# Altium schematic sheet Decap.SchDoc
size A3
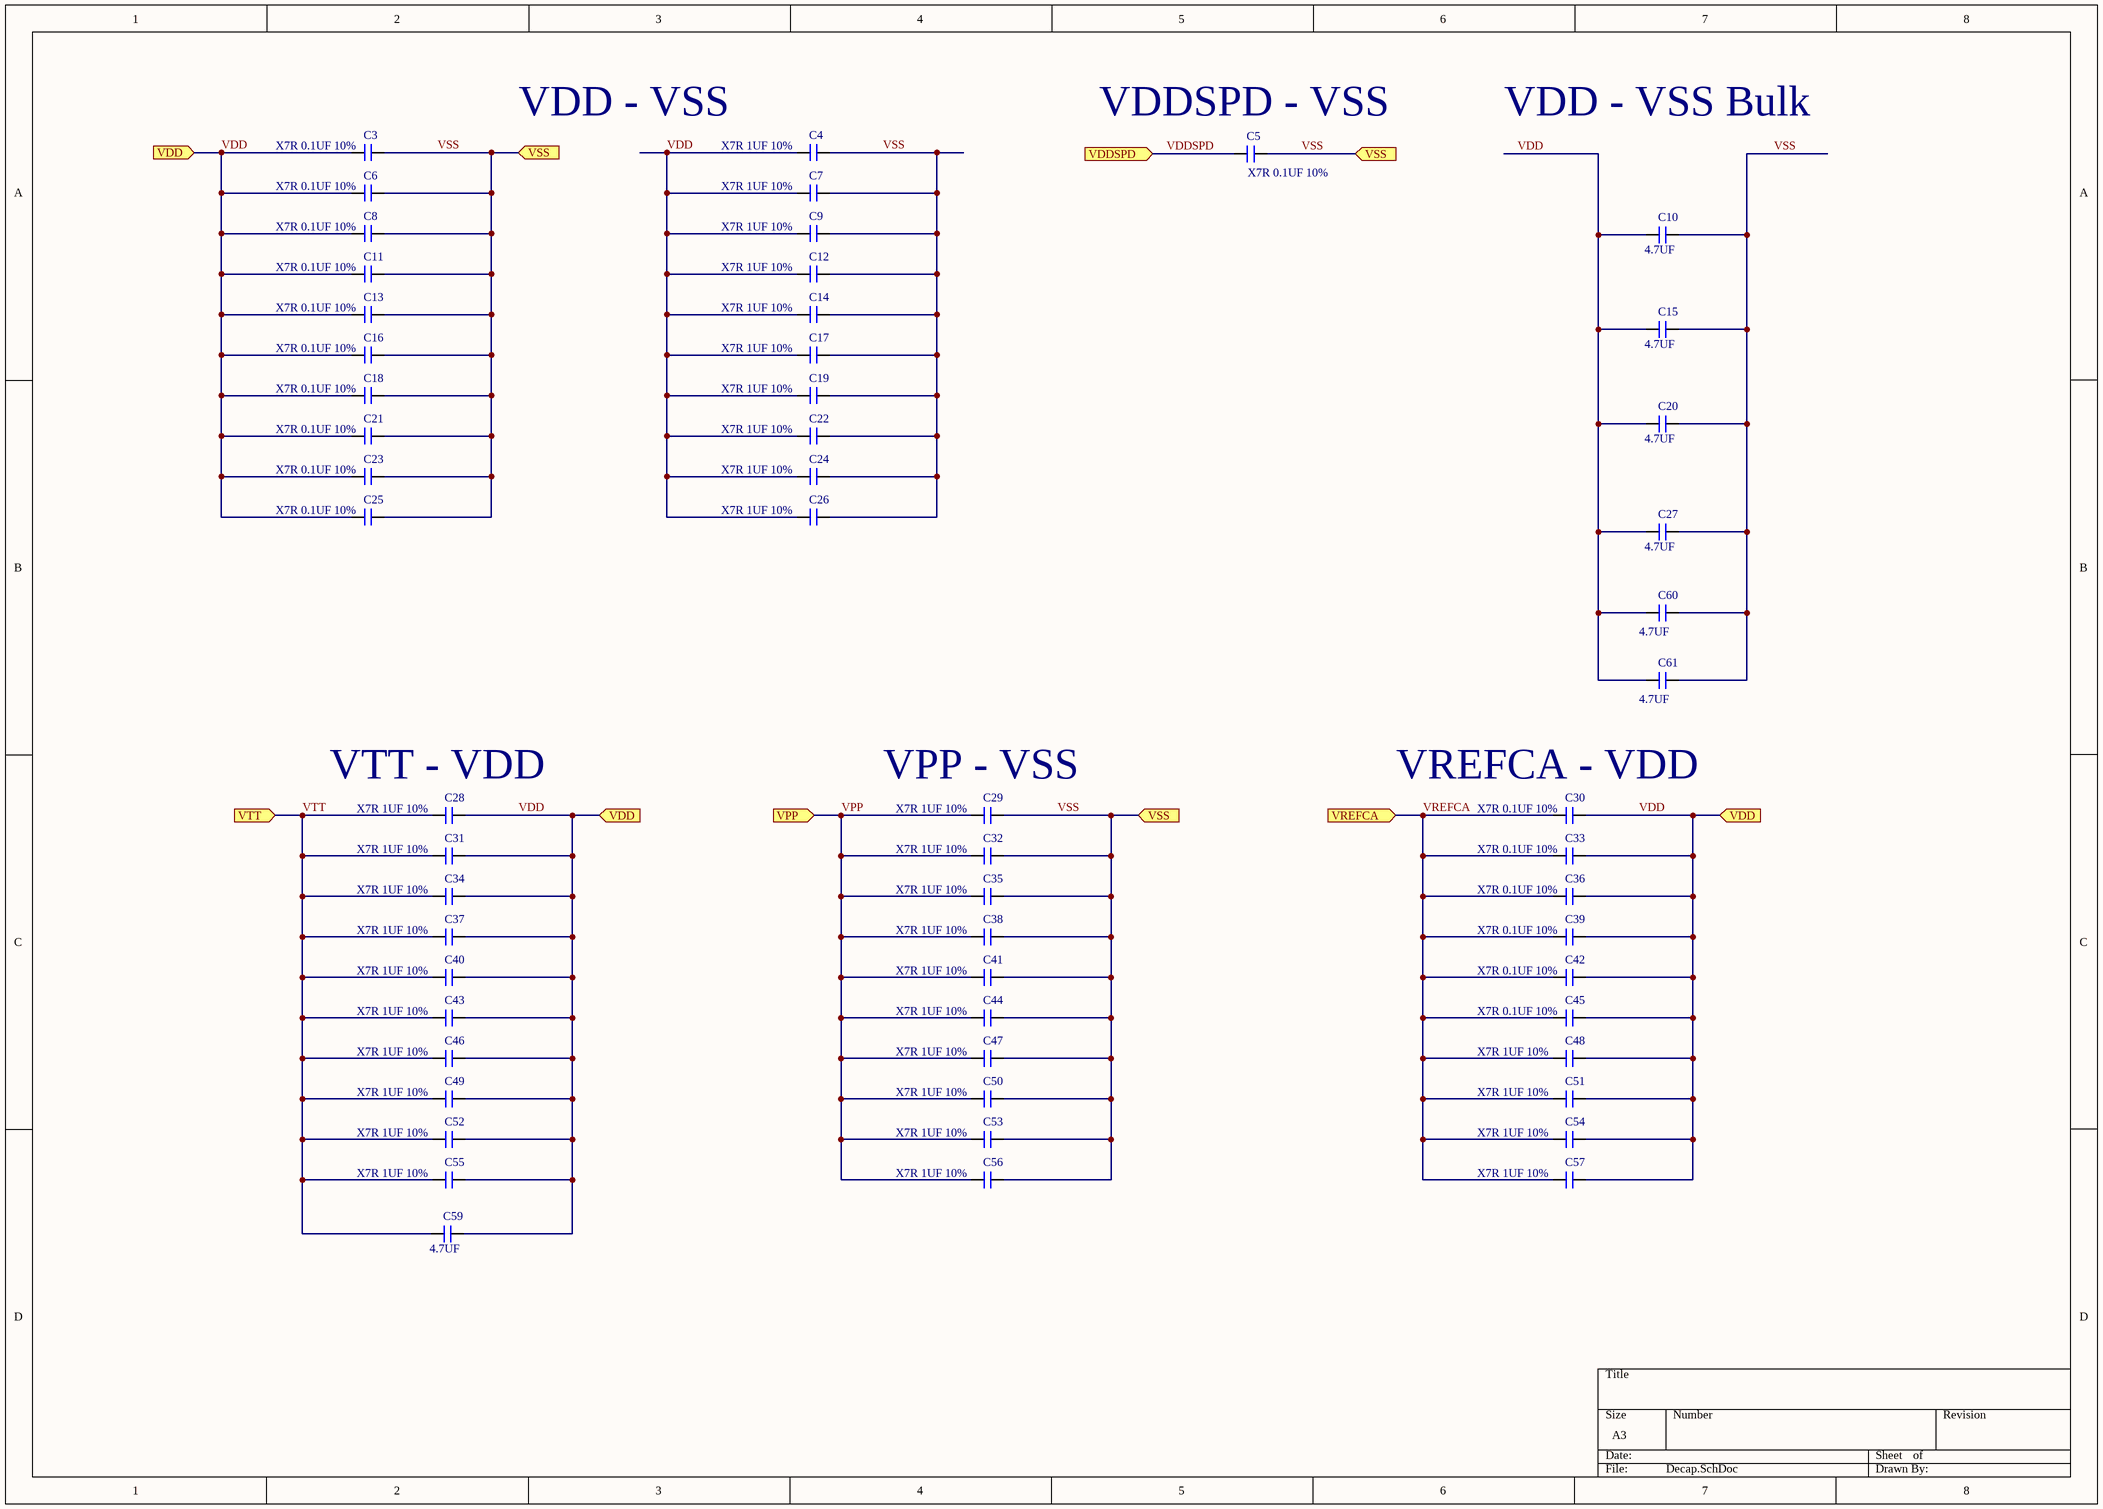
[diagram p0: Decap.SchDoc]

## Parts
C3  Capacitance: X7R 0.1UF 10%  [Capacitor 0402]  (hidden comment: Capacitor 0402)
C4  Capacitance: X7R 1UF 10%  [Capacitor 0402]  (hidden comment: Capacitor 0402)
C5  Capacitance: X7R 0.1UF 10%  [Capacitor 0402]  (hidden comment: Capacitor 0402)
C6  Capacitance: X7R 0.1UF 10%  [Capacitor 0402]  (hidden comment: Capacitor 0402)
C7  Capacitance: X7R 1UF 10%  [Capacitor 0402]  (hidden comment: Capacitor 0402)
C8  Capacitance: X7R 0.1UF 10%  [Capacitor 0402]  (hidden comment: Capacitor 0402)
C9  Capacitance: X7R 1UF 10%  [Capacitor 0402]  (hidden comment: Capacitor 0402)
C10  Capacitance: 4.7UF  [Capacitor 0603]  (hidden comment: Capacitor 0603)
C11  Capacitance: X7R 0.1UF 10%  [Capacitor 0402]  (hidden comment: Capacitor 0402)
C12  Capacitance: X7R 1UF 10%  [Capacitor 0402]  (hidden comment: Capacitor 0402)
C13  Capacitance: X7R 0.1UF 10%  [Capacitor 0402]  (hidden comment: Capacitor 0402)
C14  Capacitance: X7R 1UF 10%  [Capacitor 0402]  (hidden comment: Capacitor 0402)
C15  Capacitance: 4.7UF  [Capacitor 0603]  (hidden comment: Capacitor 0603)
C16  Capacitance: X7R 0.1UF 10%  [Capacitor 0402]  (hidden comment: Capacitor 0402)
C17  Capacitance: X7R 1UF 10%  [Capacitor 0402]  (hidden comment: Capacitor 0402)
C18  Capacitance: X7R 0.1UF 10%  [Capacitor 0402]  (hidden comment: Capacitor 0402)
C19  Capacitance: X7R 1UF 10%  [Capacitor 0402]  (hidden comment: Capacitor 0402)
C20  Capacitance: 4.7UF  [Capacitor 0603]  (hidden comment: Capacitor 0603)
C21  Capacitance: X7R 0.1UF 10%  [Capacitor 0402]  (hidden comment: Capacitor 0402)
C22  Capacitance: X7R 1UF 10%  [Capacitor 0402]  (hidden comment: Capacitor 0402)
C23  Capacitance: X7R 0.1UF 10%  [Capacitor 0402]  (hidden comment: Capacitor 0402)
C24  Capacitance: X7R 1UF 10%  [Capacitor 0402]  (hidden comment: Capacitor 0402)
C25  Capacitance: X7R 0.1UF 10%  [Capacitor 0402]  (hidden comment: Capacitor 0402)
C26  Capacitance: X7R 1UF 10%  [Capacitor 0402]  (hidden comment: Capacitor 0402)
C27  Capacitance: 4.7UF  [Capacitor 0603]  (hidden comment: Capacitor 0603)
C28  Capacitance: X7R 1UF 10%  [Capacitor 0402]  (hidden comment: Capacitor 0402)
C29  Capacitance: X7R 1UF 10%  [Capacitor 0402]  (hidden comment: Capacitor 0402)
C30  Capacitance: X7R 0.1UF 10%  [Capacitor 0402]  (hidden comment: Capacitor 0402)
C31  Capacitance: X7R 1UF 10%  [Capacitor 0402]  (hidden comment: Capacitor 0402)
C32  Capacitance: X7R 1UF 10%  [Capacitor 0402]  (hidden comment: Capacitor 0402)
C33  Capacitance: X7R 0.1UF 10%  [Capacitor 0402]  (hidden comment: Capacitor 0402)
C34  Capacitance: X7R 1UF 10%  [Capacitor 0402]  (hidden comment: Capacitor 0402)
C35  Capacitance: X7R 1UF 10%  [Capacitor 0402]  (hidden comment: Capacitor 0402)
C36  Capacitance: X7R 0.1UF 10%  [Capacitor 0402]  (hidden comment: Capacitor 0402)
C37  Capacitance: X7R 1UF 10%  [Capacitor 0402]  (hidden comment: Capacitor 0402)
C38  Capacitance: X7R 1UF 10%  [Capacitor 0402]  (hidden comment: Capacitor 0402)
C39  Capacitance: X7R 0.1UF 10%  [Capacitor 0402]  (hidden comment: Capacitor 0402)
C40  Capacitance: X7R 1UF 10%  [Capacitor 0402]  (hidden comment: Capacitor 0402)
C41  Capacitance: X7R 1UF 10%  [Capacitor 0402]  (hidden comment: Capacitor 0402)
C42  Capacitance: X7R 0.1UF 10%  [Capacitor 0402]  (hidden comment: Capacitor 0402)
C43  Capacitance: X7R 1UF 10%  [Capacitor 0402]  (hidden comment: Capacitor 0402)
C44  Capacitance: X7R 1UF 10%  [Capacitor 0402]  (hidden comment: Capacitor 0402)
C45  Capacitance: X7R 0.1UF 10%  [Capacitor 0402]  (hidden comment: Capacitor 0402)
C46  Capacitance: X7R 1UF 10%  [Capacitor 0402]  (hidden comment: Capacitor 0402)
C47  Capacitance: X7R 1UF 10%  [Capacitor 0402]  (hidden comment: Capacitor 0402)
C48  Capacitance: X7R 1UF 10%  [Capacitor 0402]  (hidden comment: Capacitor 0402)
C49  Capacitance: X7R 1UF 10%  [Capacitor 0402]  (hidden comment: Capacitor 0402)
C50  Capacitance: X7R 1UF 10%  [Capacitor 0402]  (hidden comment: Capacitor 0402)
C51  Capacitance: X7R 1UF 10%  [Capacitor 0402]  (hidden comment: Capacitor 0402)
C52  Capacitance: X7R 1UF 10%  [Capacitor 0402]  (hidden comment: Capacitor 0402)
C53  Capacitance: X7R 1UF 10%  [Capacitor 0402]  (hidden comment: Capacitor 0402)
C54  Capacitance: X7R 1UF 10%  [Capacitor 0402]  (hidden comment: Capacitor 0402)
C55  Capacitance: X7R 1UF 10%  [Capacitor 0402]  (hidden comment: Capacitor 0402)
C56  Capacitance: X7R 1UF 10%  [Capacitor 0402]  (hidden comment: Capacitor 0402)
C57  Capacitance: X7R 1UF 10%  [Capacitor 0402]  (hidden comment: Capacitor 0402)
C59  Capacitance: 4.7UF  [Capacitor 0603]  (hidden comment: Capacitor 0603)
C60  Capacitance: 4.7UF  [Capacitor 0603]  (hidden comment: Capacitor 0603)
C61  Capacitance: 4.7UF  [Capacitor 0603]  (hidden comment: Capacitor 0603)

## Ports
VDD (in), VDDSPD (in), VPP (in), VREFCA (in), VSS (in), VTT (in)

## Nets
VDD: C3.1 C4.1 C6.1 C7.1 C8.1 C9.1 C10.1 C11.1 C12.1 C13.1 C14.1 C15.1 C16.1 C17.1 C18.1 C19.1 C20.1 C21.1 C22.1 C23.1 C24.1 C25.1 C26.1 C27.1 C28.2 C30.2 C31.2 C33.2 C34.2 C36.2 C37.2 C39.2 C40.2 C42.2 C43.2 C45.2 C46.2 C48.2 C49.2 C51.2 C52.2 C54.2 C55.2 C57.2 C59.2 C60.1 C61.1 ; port VDD
VDDSPD: C5.1 ; port VDDSPD
VPP: C29.1 C32.1 C35.1 C38.1 C41.1 C44.1 C47.1 C50.1 C53.1 C56.1 ; port VPP
VREFCA: C30.1 C33.1 C36.1 C39.1 C42.1 C45.1 C48.1 C51.1 C54.1 C57.1 ; port VREFCA
VSS: C3.2 C4.2 C5.2 C6.2 C7.2 C8.2 C9.2 C10.2 C11.2 C12.2 C13.2 C14.2 C15.2 C16.2 C17.2 C18.2 C19.2 C20.2 C21.2 C22.2 C23.2 C24.2 C25.2 C26.2 C27.2 C29.2 C32.2 C35.2 C38.2 C41.2 C44.2 C47.2 C50.2 C53.2 C56.2 C60.2 C61.2 ; port VSS
VTT: C28.1 C31.1 C34.1 C37.1 C40.1 C43.1 C46.1 C49.1 C52.1 C55.1 C59.1 ; port VTT

## Notes on the sheet
- VDD - VSS
- (near C5) VDDSPD - VSS
- VDD - VSS Bulk
- (near C28) VTT - VDD
- (near C29) VPP - VSS
- (near C30) VREFCA - VDD

## Library data of the parts
C3-C9 C11-C14 C16-C19 C21-C26 C28-C57 = Capacitor 0201: Manufacturer: Vishay; Manufacturer Part Number: CRCW060310K0FKEA; Max Power Dissipation: 100mW; Tolerance: 1%; Voltage Rating: 75V; Temperature Coefficient: 100ppm/°C; Supplier 1: Avnet Europe; Stock 1: 305000; Pricing 1: 5000=0.00444, 10000=0.00432, 20000=0.00421, 30000=0.0041, 40000=0.004 (EUR); Case/Package: 0201; Number of Pins: 2; Weight: 7.1E-05oz; Contact Plating: Tin,Lead; Case Code (Metric): 0603; Case Code (Imperial): 0201; Min Operating Temperature: -55°C; Max Operating Temperature: 155°C; Packaging: Tape and Reel; Package Quantity: 10; Termination: SMD/SMT; Power Rating: 100mW; Composition: Thick Film; Number of Terminations: 2; Military Standard: Not; Voltage Rating (DC): 75V; Features: Automotive AEC-Q200; Length: 1.55mm; Height: 0.45mm; Width: 0.033inch; Depth: 0.85mm; Radiation Hardening: No; REACH SVHC: Unknown; Lead Free: Lead Free
C10 C15 C20 C27 C59-C61 = Capacitor 0603: Manufacturer: Vishay; Manufacturer Part Number: CRCW060310K0FKEA; Max Power Dissipation: 100mW; Tolerance: 1%; Voltage Rating: 75V; Temperature Coefficient: 100ppm/°C; Supplier 1: Avnet Europe; Stock 1: 305000; Pricing 1: 5000=0.00444, 10000=0.00432, 20000=0.00421, 30000=0.0041, 40000=0.004 (EUR); Case/Package: 0603; Number of Pins: 2; Weight: 7.1E-05oz; Contact Plating: Tin,Lead; Case Code (Metric): 1608; Case Code (Imperial): 0603; Min Operating Temperature: -55°C; Max Operating Temperature: 155°C; Packaging: Tape and Reel; Package Quantity: 10; Termination: SMD/SMT; Power Rating: 100mW; Composition: Thick Film; Number of Terminations: 2; Military Standard: Not; Voltage Rating (DC): 75V; Features: Automotive AEC-Q200; Length: 1.55mm; Height: 0.45mm; Width: 0.033inch; Depth: 0.85mm; Radiation Hardening: No; REACH SVHC: Unknown; Lead Free: Lead Free